# EAGLE schematic Puddles_Backplane FOR REFERENCE (EAGLE 9.5.2)

## Sheet 1 of 3: Back Plane
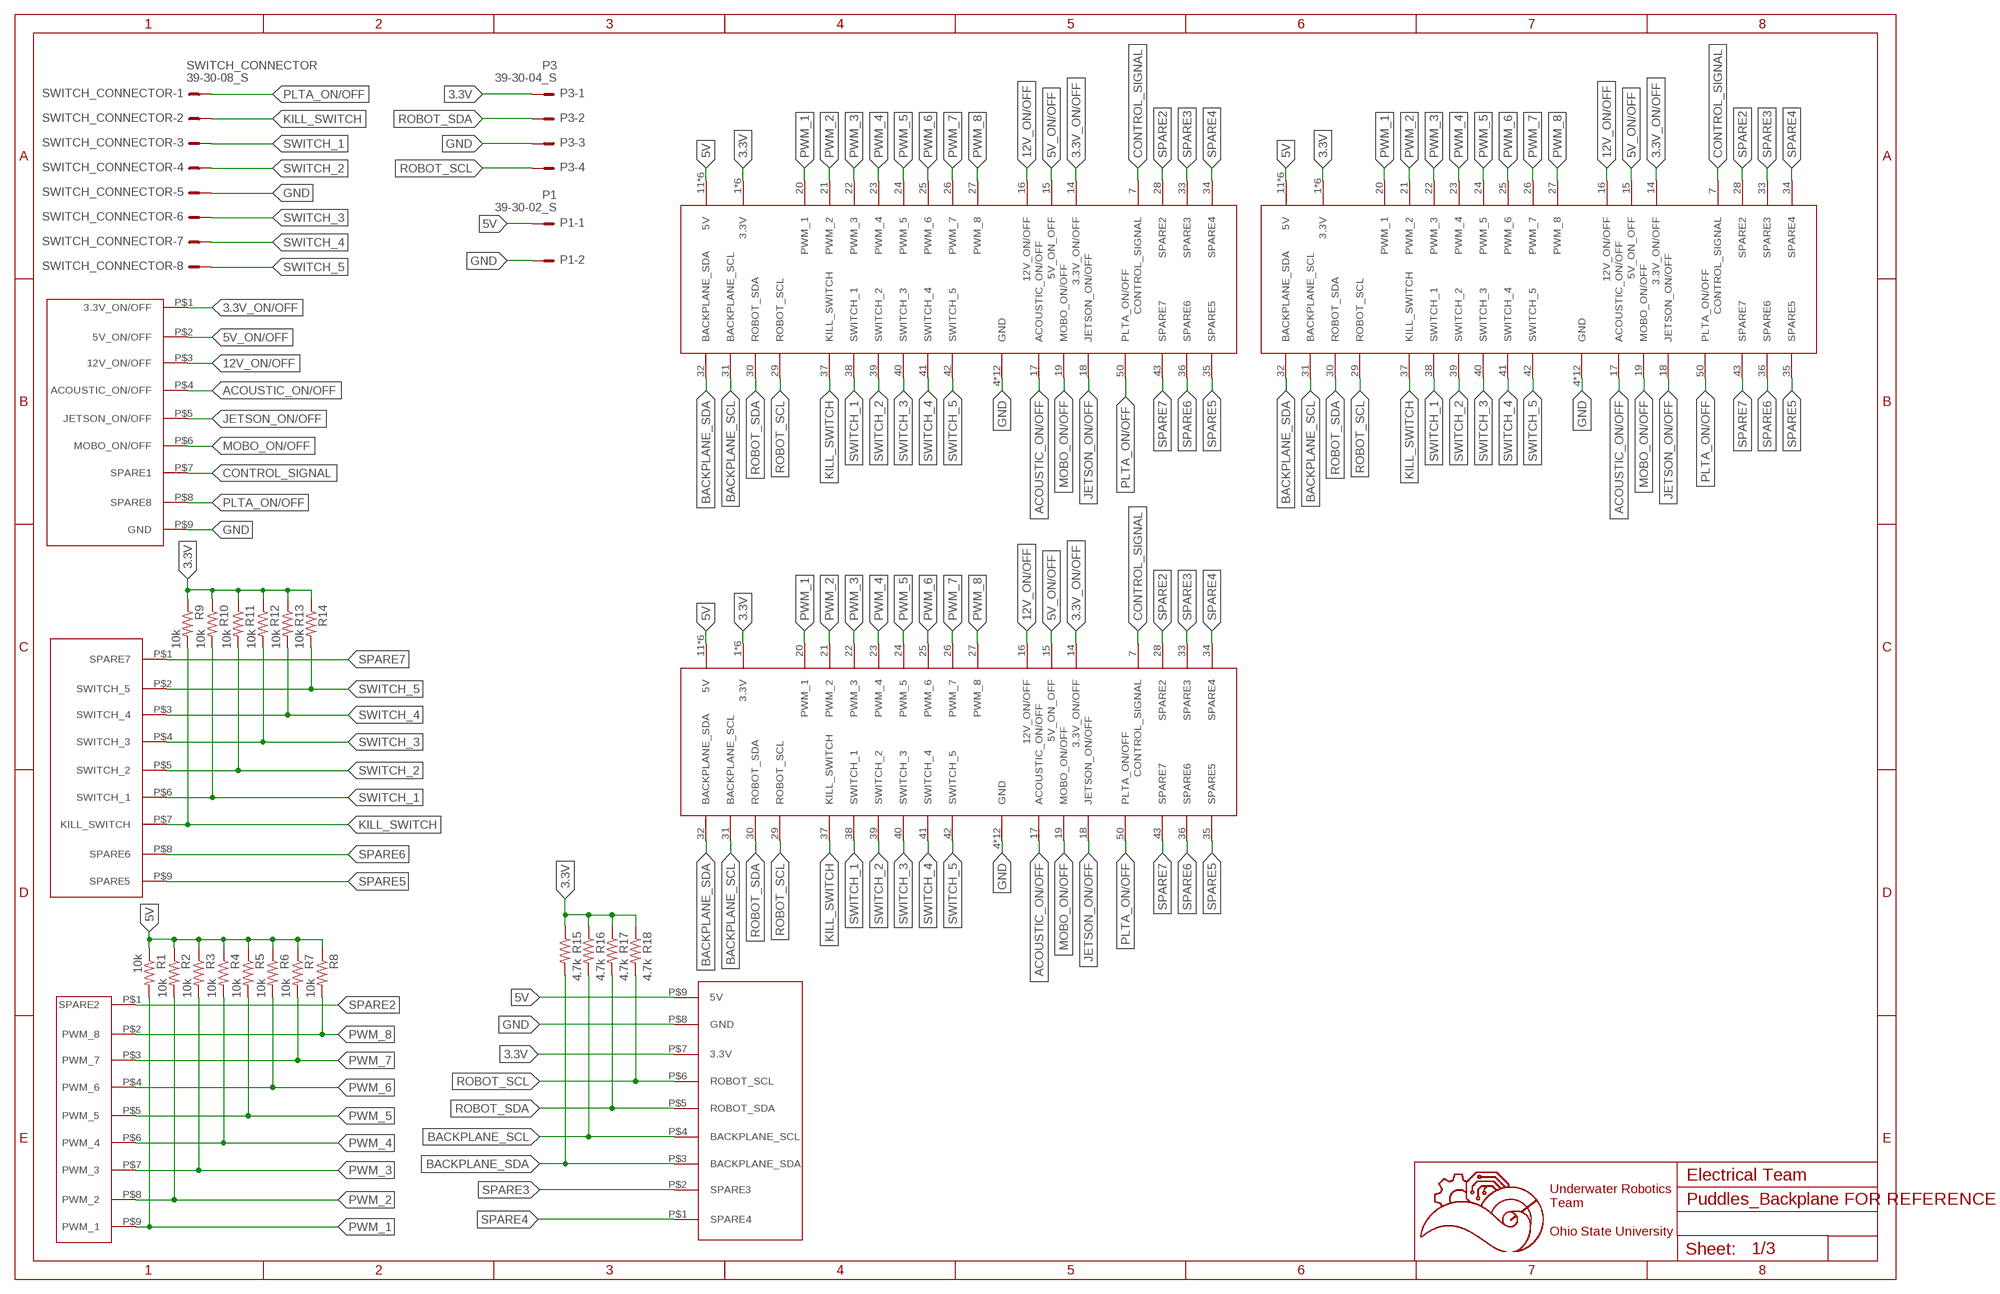
[diagram p0: schematic, sheet 1]

### Parts
P1  39-30-02_S  [39-30-?02?]
P3  39-30-04_S  [39-30-?04?]
R1  10k  R-US_R0603  [R0603]
R2  10k  R-US_R0603  [R0603]
R3  10k  R-US_R0603  [R0603]
R4  10k  R-US_R0603  [R0603]
R5  10k  R-US_R0603  [R0603]
R6  10k  R-US_R0603  [R0603]
R7  10k  R-US_R0603  [R0603]
R8  10k  R-US_R0603  [R0603]
R9  10k  R-US_R0603  [R0603]
R10  10k  R-US_R0603  [R0603]
R11  10k  R-US_R0603  [R0603]
R12  10k  R-US_R0603  [R0603]
R13  10k  R-US_R0603  [R0603]
R14  10k  R-US_R0603  [R0603]
R15  4.7k  R-US_R0603  [R0603]
R16  4.7k  R-US_R0603  [R0603]
R17  4.7k  R-US_R0603  [R0603]
R18  4.7k  R-US_R0603  [R0603]
SWITCH_CONNECTOR  39-30-08_S  [39-30-?08?]
U$1  5530843-FEMALE  [5530843-6-BACKPLANEMATE]
U$2  5530843-FEMALE  [5530843-6-BACKPLANEMATE]
U$3  5530843-FEMALE  [5530843-6-BACKPLANEMATE]
U$5  929870-01-09_1  [929852-01-09_1ROW]
U$6  929870-01-09_2  [929852-01-09_1ROW]
U$7  929870-01-09_3  [929852-01-09_1ROW]
U$8  929870-01-09_4  [929852-01-09_1ROW]

### Nets
3.3V: P3.1 R9.1 R10.1 R11.1 R12.1 R13.1 R14.1 R15.1 R16.1 R17.1 R18.1 U$1.1(3.3V) U$1.2(3.3V) U$1.3(3.3V) U$1.54(3.3V) U$1.55(3.3V) U$1.56(3.3V) U$2.1(3.3V) U$2.2(3.3V) U$2.3(3.3V) U$2.54(3.3V) U$2.55(3.3V) U$2.56(3.3V) U$3.1(3.3V) U$3.2(3.3V) U$3.3(3.3V) U$3.54(3.3V) U$3.55(3.3V) U$3.56(3.3V) U$8.P$7(3.3V) ; also sheet 2
3.3V_ON/OFF: U$1.14(3.3V_ON/OFF) U$2.14(3.3V_ON/OFF) U$3.14(3.3V_ON/OFF) U$7.P$1(3.3V_ON/OFF)
5V: P1.1 R1.1 R2.1 R3.1 R4.1 R5.1 R6.1 R7.1 R8.1 U$1.11(5V) U$1.12(5V) U$1.13(5V) U$1.44(5V) U$1.45(5V) U$1.46(5V) U$2.11(5V) U$2.12(5V) U$2.13(5V) U$2.44(5V) U$2.45(5V) U$2.46(5V) U$3.11(5V) U$3.12(5V) U$3.13(5V) U$3.44(5V) U$3.45(5V) U$3.46(5V) U$8.P$9(5V)
5V_ON/OFF: U$1.15(5V_ON_OFF) U$2.15(5V_ON_OFF) U$3.15(5V_ON_OFF) U$7.P$2(5V_ON/OFF)
12V_ON/OFF: U$1.16(12V_ON/OFF) U$2.16(12V_ON/OFF) U$3.16(12V_ON/OFF) U$7.P$3(12V_ON/OFF)
ACOUSTIC_ON/OFF: U$1.17(ACOUSTIC_ON/OFF) U$2.17(ACOUSTIC_ON/OFF) U$3.17(ACOUSTIC_ON/OFF) U$7.P$4(ACOUSTIC_ON/OFF)
BACKPLANE_SCL: R16.2 U$1.31(BACKPLANE_SCL) U$2.31(BACKPLANE_SCL) U$3.31(BACKPLANE_SCL) U$8.P$4(BACKPLANE_SCL) ; also sheet 2
BACKPLANE_SDA: R15.2 U$1.32(BACKPLANE_SDA) U$2.32(BACKPLANE_SDA) U$3.32(BACKPLANE_SDA) U$8.P$3(BACKPLANE_SDA) ; also sheet 2
CONTROL_SIGNAL: U$1.7(CONTROL_SIGNAL) U$2.7(CONTROL_SIGNAL) U$3.7(CONTROL_SIGNAL) U$7.P$7(SPARE1)
GND: P1.2 P3.3 SWITCH_CONNECTOR.5 U$1.4(GND) U$1.5(GND) U$1.6(GND) U$1.8(GND) U$1.9(GND) U$1.10(GND) U$1.47(GND) U$1.48(GND) U$1.49(GND) U$1.51(GND) U$1.52(GND) U$1.53(GND) U$2.4(GND) U$2.5(GND) U$2.6(GND) U$2.8(GND) U$2.9(GND) U$2.10(GND) U$2.47(GND) U$2.48(GND) U$2.49(GND) U$2.51(GND) U$2.52(GND) U$2.53(GND) U$3.4(GND) U$3.5(GND) U$3.6(GND) U$3.8(GND) U$3.9(GND) U$3.10(GND) U$3.47(GND) U$3.48(GND) U$3.49(GND) U$3.51(GND) U$3.52(GND) U$3.53(GND) U$7.P$9(GND) U$8.P$8(GND) ; also sheet 2,3
JETSON_ON/OFF: U$1.18(JETSON_ON/OFF) U$2.18(JETSON_ON/OFF) U$3.18(JETSON_ON/OFF) U$7.P$5(JETSON_ON/OFF)
KILL_SWITCH: R9.2 SWITCH_CONNECTOR.2 U$1.37(KILL_SWITCH) U$2.37(KILL_SWITCH) U$3.37(KILL_SWITCH) U$5.P$7(KILL_SWITCH)
MOBO_ON/OFF: U$1.19(MOBO_ON/OFF) U$2.19(MOBO_ON/OFF) U$3.19(MOBO_ON/OFF) U$7.P$6(MOBO_ON/OFF)
PLTA_ON/OFF: SWITCH_CONNECTOR.1 U$1.50(PLTA_ON/OFF) U$2.50(PLTA_ON/OFF) U$3.50(PLTA_ON/OFF) U$7.P$8(SPARE8)
PWM_1: R1.2 U$1.20(PWM_1) U$2.20(PWM_1) U$3.20(PWM_1) U$6.P$9(PWM_1)
PWM_2: R2.2 U$1.21(PWM_2) U$2.21(PWM_2) U$3.21(PWM_2) U$6.P$8(PWM_2)
PWM_3: R3.2 U$1.22(PWM_3) U$2.22(PWM_3) U$3.22(PWM_3) U$6.P$7(PWM_3)
PWM_4: R4.2 U$1.23(PWM_4) U$2.23(PWM_4) U$3.23(PWM_4) U$6.P$6(PWM_4)
PWM_5: R5.2 U$1.24(PWM_5) U$2.24(PWM_5) U$3.24(PWM_5) U$6.P$5(PWM_5)
PWM_6: R6.2 U$1.25(PWM_6) U$2.25(PWM_6) U$3.25(PWM_6) U$6.P$4(PWM_6)
PWM_7: R7.2 U$1.26(PWM_7) U$2.26(PWM_7) U$3.26(PWM_7) U$6.P$3(PWM_7)
PWM_8: R8.2 U$1.27(PWM_8) U$2.27(PWM_8) U$3.27(PWM_8) U$6.P$2(PWM_8)
ROBOT_SCL: P3.4 R18.2 U$1.29(ROBOT_SCL) U$2.29(ROBOT_SCL) U$3.29(ROBOT_SCL) U$8.P$6(ROBOT_SCL) ; also sheet 2
ROBOT_SDA: P3.2 R17.2 U$1.30(ROBOT_SDA) U$2.30(ROBOT_SDA) U$3.30(ROBOT_SDA) U$8.P$5(ROBOT_SDA) ; also sheet 2
SPARE2: U$1.28(SPARE2) U$2.28(SPARE2) U$3.28(SPARE2) U$6.P$1(SPARE2)
SPARE3: U$1.33(SPARE3) U$2.33(SPARE3) U$3.33(SPARE3) U$8.P$2(SPARE3)
SPARE4: U$1.34(SPARE4) U$2.34(SPARE4) U$3.34(SPARE4) U$8.P$1(SPARE4)
SPARE5: U$1.35(SPARE5) U$2.35(SPARE5) U$3.35(SPARE5) U$5.P$9(SPARE5)
SPARE6: U$1.36(SPARE6) U$2.36(SPARE6) U$3.36(SPARE6) U$5.P$8(SPARE6)
SPARE7: U$1.43(SPARE7) U$2.43(SPARE7) U$3.43(SPARE7) U$5.P$1(SPARE7)
SWITCH_1: R10.2 SWITCH_CONNECTOR.3 U$1.38(SWITCH_1) U$2.38(SWITCH_1) U$3.38(SWITCH_1) U$5.P$6(SWITCH_1)
SWITCH_2: R11.2 SWITCH_CONNECTOR.4 U$1.39(SWITCH_2) U$2.39(SWITCH_2) U$3.39(SWITCH_2) U$5.P$5(SWITCH_2)
SWITCH_3: R12.2 SWITCH_CONNECTOR.6 U$1.40(SWITCH_3) U$2.40(SWITCH_3) U$3.40(SWITCH_3) U$5.P$4(SWITCH_3)
SWITCH_4: R13.2 SWITCH_CONNECTOR.7 U$1.41(SWITCH_4) U$2.41(SWITCH_4) U$3.41(SWITCH_4) U$5.P$3(SWITCH_4)
SWITCH_5: R14.2 SWITCH_CONNECTOR.8 U$1.42(SWITCH_5) U$2.42(SWITCH_5) U$3.42(SWITCH_5) U$5.P$2(SWITCH_5)

### Notes on the sheet
- Electrical Team
- Underwater Robotics
  Team
  
  Ohio State University

## Sheet 2 of 3: Microcontroller
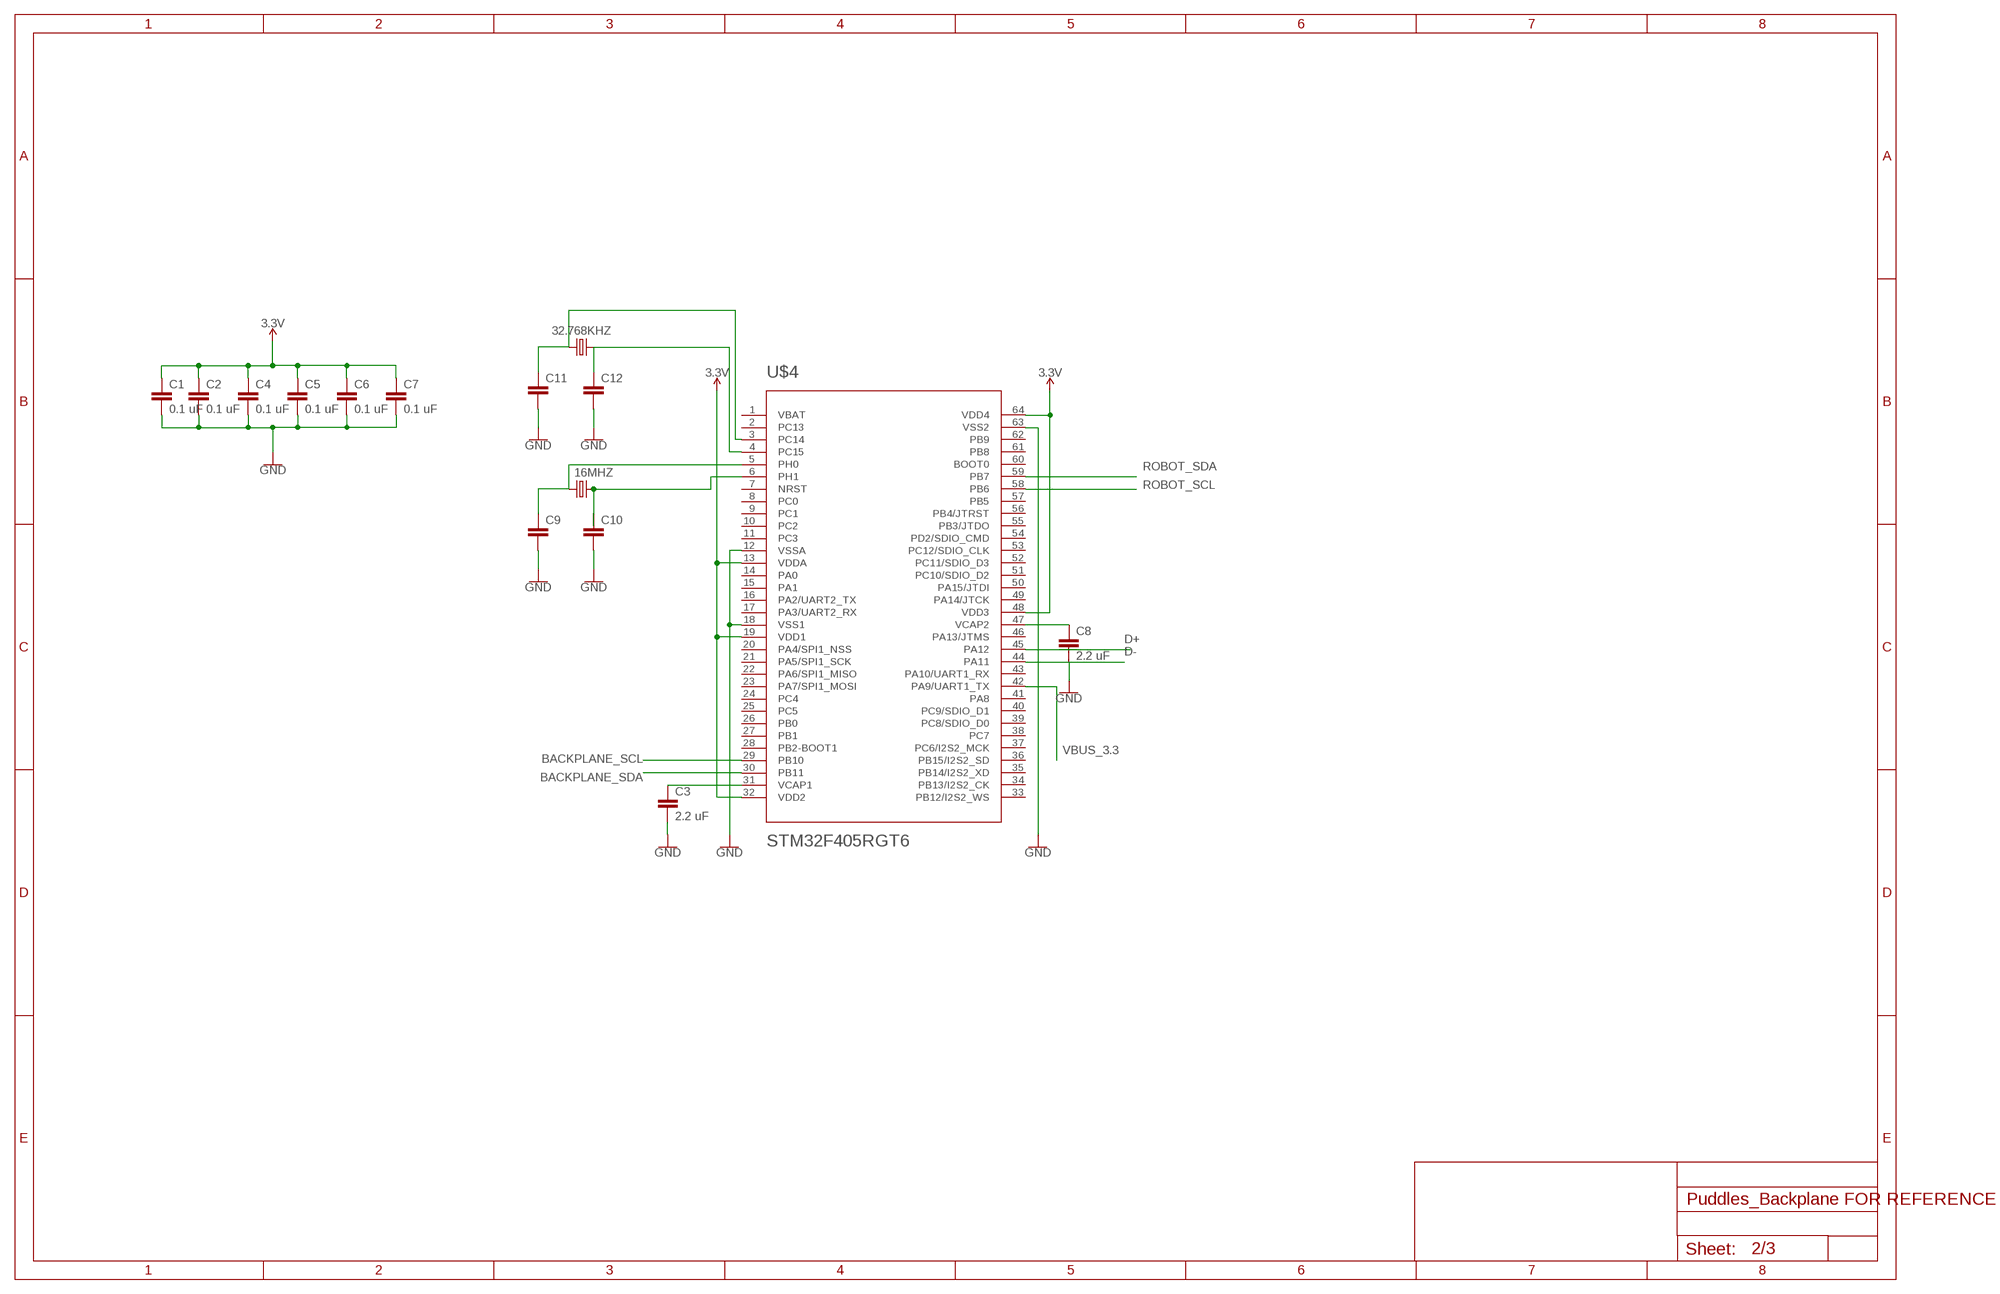
[diagram p1: schematic, sheet 2]

### Parts
16MHZ  CRYSTALPTH-HC49US  [HC49US]
32.768KHZ  CRYSTALPTH-HC49US  [HC49US]
C1  0.1 uF  C-EUC0603  [C0603]
C2  0.1 uF  C-EUC0603  [C0603]
C3  2.2 uF  C-EUC0603  [C0603]
C4  0.1 uF  C-EUC0603  [C0603]
C5  0.1 uF  C-EUC0603  [C0603]
C6  0.1 uF  C-EUC0603  [C0603]
C7  0.1 uF  C-EUC0603  [C0603]
C8  2.2 uF  C-EUC0603  [C0603]
C9  C-EUC0603  [C0603]
C10  C-EUC0603  [C0603]
C11  C-EUC0603  [C0603]
C12  C-EUC0603  [C0603]
U$4  STM32F405RGT6  STM32F405RG  [TQFP64]

### Nets
3.3V: C1.1 C2.1 C4.1 C5.1 C6.1 C7.1 U$4.13(VDDA) U$4.19(VDD1) U$4.32(VDD2) U$4.48(VDD3) U$4.64(VDD4) ; also sheet 1
BACKPLANE_SCL: U$4.29(PB10) ; also sheet 1
BACKPLANE_SDA: U$4.30(PB11) ; also sheet 1
D+: U$4.45(PA12) ; also sheet 3
D-: U$4.44(PA11) ; also sheet 3
GND: C1.2 C2.2 C3.2 C4.2 C5.2 C6.2 C7.2 C8.2 C9.2 C10.2 C11.2 C12.2 U$4.12(VSSA) U$4.18(VSS1) U$4.63(VSS2) ; also sheet 1,3
N$1: C3.1 U$4.31(VCAP1)
N$2: C8.1 U$4.47(VCAP2)
N$3: 16MHZ.1 C9.1 U$4.5(PH0)
N$4: 16MHZ.2 C10.1 U$4.6(PH1)
N$5: 32.768KHZ.1 C11.1 U$4.3(PC14)
N$6: 32.768KHZ.2 C12.1 U$4.4(PC15)
ROBOT_SCL: U$4.58(PB6) ; also sheet 1
ROBOT_SDA: U$4.59(PB7) ; also sheet 1
VBUS_3.3: U$4.42(PA9/UART1_TX) ; also sheet 3
Unconnected: U$4.1(VBAT) U$4.2(PC13) U$4.7(NRST) U$4.8(PC0) U$4.9(PC1) U$4.10(PC2) U$4.11(PC3) U$4.14(PA0) U$4.15(PA1) U$4.16(PA2/UART2_TX) U$4.17(PA3/UART2_RX) U$4.20(PA4/SPI1_NSS) U$4.21(PA5/SPI1_SCK) U$4.22(PA6/SPI1_MISO) U$4.23(PA7/SPI1_MOSI) U$4.24(PC4) U$4.25(PC5) U$4.26(PB0) U$4.27(PB1) U$4.28(PB2-BOOT1) U$4.33(PB12/I2S2_WS) U$4.34(PB13/I2S2_CK) U$4.35(PB14/I2S2_XD) U$4.36(PB15/I2S2_SD) U$4.37(PC6/I2S2_MCK) U$4.38(PC7) U$4.39(PC8/SDIO_D0) U$4.40(PC9/SDIO_D1) U$4.41(PA8) U$4.43(PA10/UART1_RX) U$4.46(PA13/JTMS) U$4.49(PA14/JTCK) U$4.50(PA15/JTDI) U$4.51(PC10/SDIO_D2) U$4.52(PC11/SDIO_D3) U$4.53(PC12/SDIO_CLK) U$4.54(PD2/SDIO_CMD) U$4.55(PB3/JTDO) U$4.56(PB4/JTRST) U$4.57(PB5) U$4.60(BOOT0) U$4.61(PB8) U$4.62(PB9)

## Sheet 3 of 3: Connectors
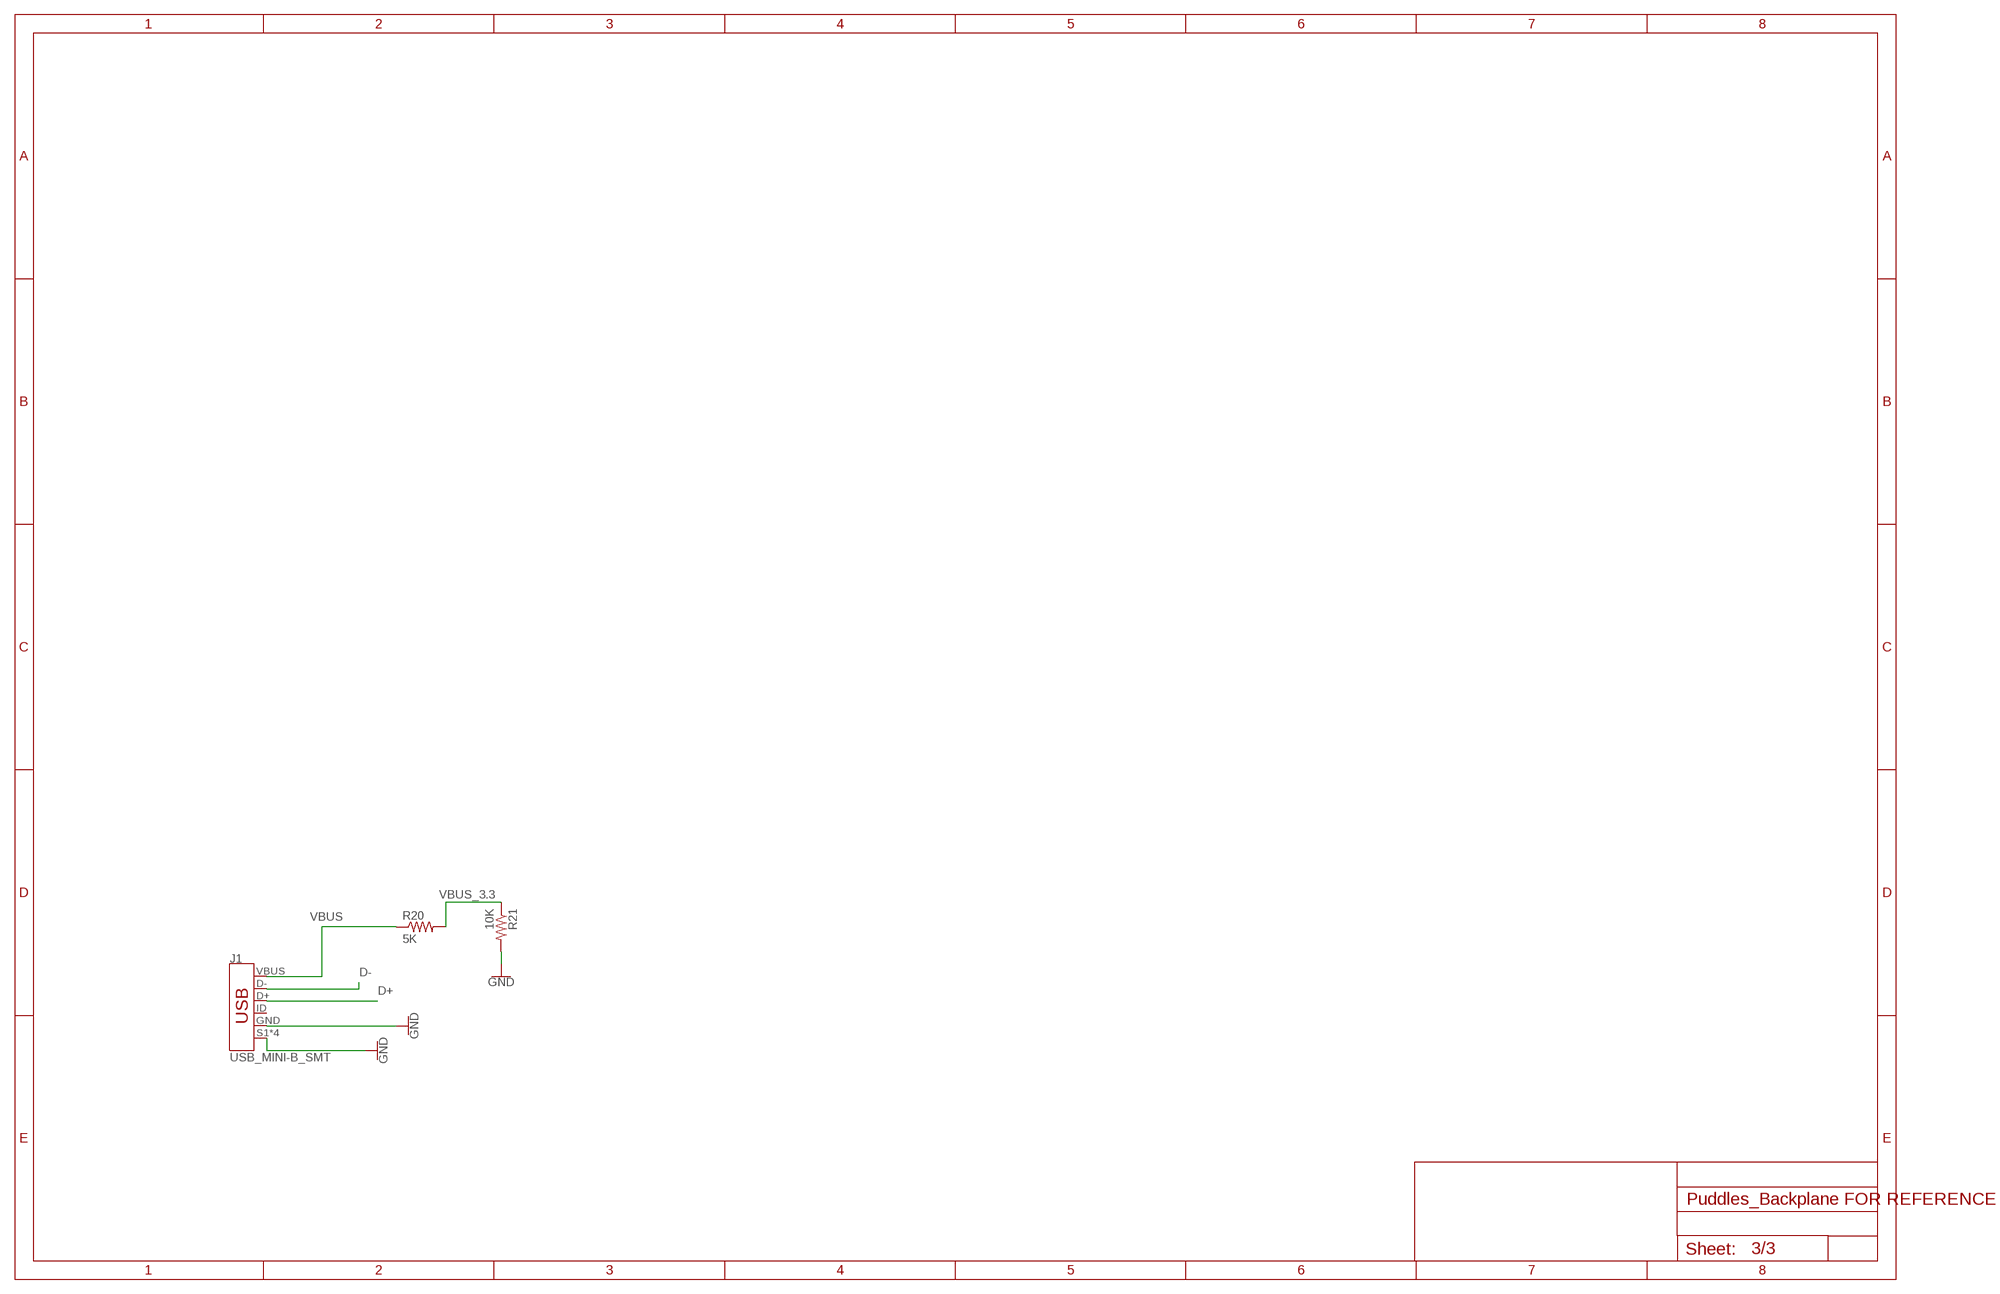
[diagram p2: schematic, sheet 3]

### Parts
J1  USB_MINI-B_SMT  [USB-MINIB]
R20  5K  R-US_R0603  [R0603]
R21  10K  R-US_R0603  [R0603]

### Nets
D+: J1.D+ ; also sheet 2
D-: J1.D- ; also sheet 2
GND: J1.GND J1.S1(SHIELD) J1.S2(SHIELD) J1.S3(SHIELD) J1.S4(SHIELD) R21.2 ; also sheet 1,2
VBUS: J1.VBUS R20.1
VBUS_3.3: R20.2 R21.1 ; also sheet 2
Unconnected: J1.ID

## Library data of the parts
16MHZ 32.768KHZ = SparkFun-Clocks:CRYSTAL: Crystals (Generic) These are passive quartz crystals, which can be used as a clock source for a microcontroller. Crystal's are two-terminal devices. They require external "load" capacitors to generate an oscillating signal.
C1-C12 = rcl:C-EU: CAPACITOR, European symbol; SPICEPREFIX: C
J1 = SparkFun-Connectors:USB_MINI-B: USB type Mini-B Connector Breaks out 5th pin, and includes shield pins if needed. SparkFun Products: SparkFun FTDI Basic Breakout <https://www.sparkfun.com/products/9716> SparkFun XBee Explorer USB <https://www.sparkfun.com/products/11812> SparkFun Redboard <https://www.sparkfun.com/products/12757>; PROD_ID: CONN-08193; SF_ID: PRT-00587
P1 = con-molex-mini-fit:39-30-?02?_S: HEADER
P3 = con-molex-mini-fit:39-30-?04?_S: HEADER
R1-R18 R20 R21 = rcl:R-US_: RESISTOR, American symbol; SPICEPREFIX: R
SWITCH_CONNECTOR = con-molex-mini-fit:39-30-?08?_S: HEADER
U$1-U$3 = 5530843-6:5530843-FEMALE
U$4 = SparkFun-IC-Microcontroller:STM32F405RG: STM32F405RGT6 ARM DSP Chip used on the WAV Trigger board. IC MCU 32BIT 1MB FLASH 64LQFP Datasheet <https://cdn.sparkfun.com/datasheets/Widgets/STM32F405RGT6.pdf> SparkFun Products WAV Trigger <https://www.sparkfun.com/products/13660> (WIG-13660); PROD_ID: IC-11709
U$5 = 3M_929852_Connector:929870-01-09_1
U$6 = 3M_929852_Connector:929870-01-09_2
U$7 = 3M_929852_Connector:929870-01-09_3
U$8 = 3M_929852_Connector:929870-01-09_4